# EAGLE design relais platine v2 (EAGLE 6.1)
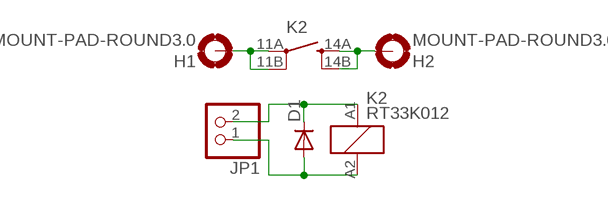
[diagram p0: schematic, sheet 1]

## Parts
D1  DIODE-D-5  [D-5]
H1  MOUNT-PAD-ROUND3.0  [3,0-PAD]
H2  MOUNT-PAD-ROUND3.0  [3,0-PAD]
JP1  PINHD-1X2  [1X02]
K2  RT33K012  [RT-N/O16A5]

## Nets
IN: H1.B3,0(MOUNT) K2.11A(2:PA) K2.11B(2:PB)
N$5: D1.C JP1.2 K2.A1
N$6: D1.A JP1.1 K2.A2
OUT: H2.B3,0(MOUNT) K2.14A(2:SA) K2.14B(2:SB)

## Library data of the parts
D1 = diode:DIODE-: DIODE
H1 H2 = holes:MOUNT-PAD-ROUND: MOUNTING PAD, round
JP1 = pinhead:PINHD-1X2: PIN HEADER
K2 = relay:RT33*: Power PCB Relay Inrush SCHRACK 1 pole 16 A, for inrush peak currents up to 80 A Source: http://www.schrack.com/.. 5825.pdf; MPN: RT33K012; OC_FARNELL: unknown; OC_NEWARK: 48M7964

## Board
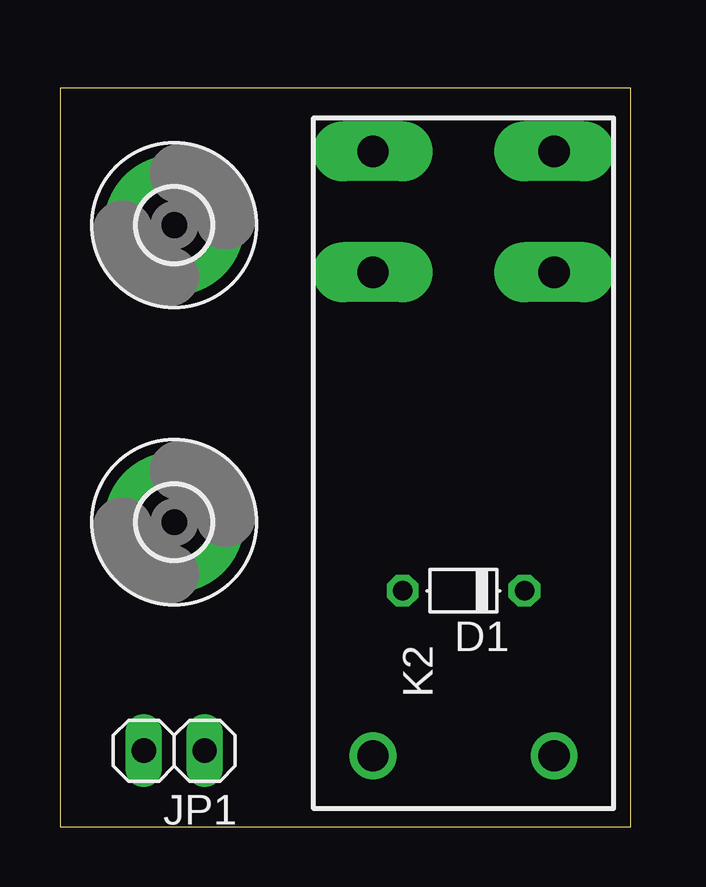
[diagram p1: board, top side]
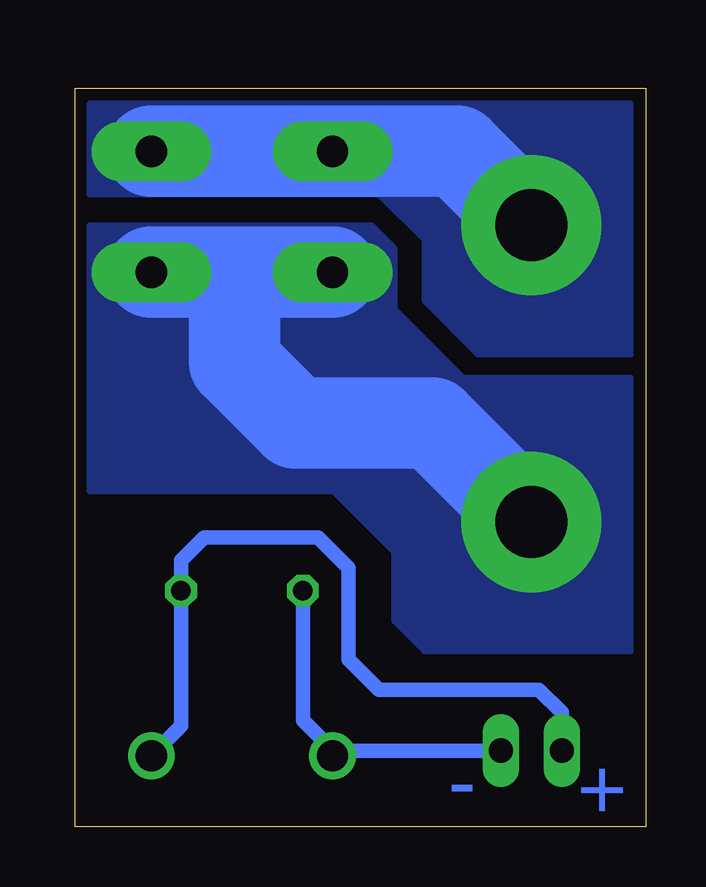
[diagram p2: board, bottom side, seen from below]

Size 23.79 x 30.79 mm. Coordinates in mm from the lower left corner, seen from the top.
Outline: 0,0 23.79,0 23.79,30.79 0,30.79 0,0
Copper layers (1*16): Top 0.035mm / dielectric 1.5mm / Bottom 0.035mm
Design rules: minimum track width 10mil, minimum drill 24mil, track to track 12mil, track to pad 12mil, pad to pad 12mil, via to via 12mil, smd to smd 10mil, copper to edge 12mil, drill to drill 12mil, minimum pad ring 10mil, minimum via ring 10mil, stop-mask expansion 4mil, vias tented up to drill 0mil, thermal gap 12mil

### Footprints (pad centres in the part's own frame; a part is rotated, then mirrored left to right if it is on the bottom)
D-5 = drill 0.813 octagon: A 2.54,0; C -2.54,0
3,0-PAD = drill 3 pad 5.842: B3,0 0,0
1X02 = drill 1.016 long: 1 -1.27,0; 2 1.27,0
RT-N/O16A5 = drill 1.3 pad 2.5 long: 11A 7.56,3.78; 11B 7.56,-3.78; 14A 12.6,3.78; 14B 12.6,-3.78 | drill 1.3: A1 -12.6,-3.78; A2 -12.6,3.78

### Placement (x,y rotation side)
D1  16.83,9.84 180 top
H1  4.76,12.7 0 top
H2  4.76,25.08 0 top
JP1  4.76,3.17 180 top
K2  16.83,15.56 90 top

### Tracks (layer width: path | path; a pad name or v marks a point on that pad's centre or on a via)
IN
  Bottom 3.81: H1.B3,0 8.89,16.83 14.61,16.83 17.14,19.37 17.14,23.12 | K2.11B 17.14,23.12 | 17.14,23.12 K2.11A
  pour Bottom (no thermals): 0.64,18.73 0.64,7.3 9.21,7.3 10.48,8.57 10.48,11.43 13.02,13.97 23.18,13.97 23.18,25.08 11.43,25.08 10.48,24.13 10.48,21.59 7.62,18.73
N$5
  Bottom 0.61: K2.A1 19.37,4.2 D1.C 19.37,11.11 18.41,12.06 13.65,12.06 12.38,10.79 12.38,6.99 11.11,5.71 4.45,5.71 3.49,4.76 JP1.2
N$6
  Bottom 0.61: JP1.1 13.02,3.17 | 13.02,3.17 14.29,4.45 D1.A | K2.A2 13.05,3.15 13.02,3.17
OUT
  Bottom 3.81: K2.14B K2.14A 7.84,28.16 H2.B3,0
  pour Bottom (no thermals): 23.18,30.16 0.64,30.16 0.64,19.68 6.99,19.68 9.21,21.91 9.21,24.45 11.11,26.35 23.18,26.35

### Text on the board
Bottom: - | +